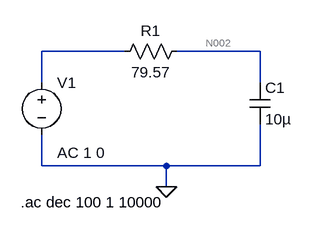
[diagram p0: schematic Diagrama_Ej2.asc]
Diagrama_Ej2.asc, the LTspice schematic file:
Version 4
SHEET 1 880 680
WIRE 160 80 32 80
WIRE 368 80 240 80
WIRE 32 128 32 80
WIRE 368 128 368 80
WIRE 32 256 32 208
WIRE 224 256 32 256
WIRE 368 256 368 192
WIRE 368 256 224 256
WIRE 224 288 224 256
FLAG 224 288 0
SYMBOL voltage 32 112 R0
WINDOW 123 24 124 Left 2
WINDOW 39 0 0 Left 0
SYMATTR Value2 AC 1 0
SYMATTR InstName V1
SYMATTR Value ""
SYMBOL res 144 96 R270
WINDOW 0 32 56 VTop 2
WINDOW 3 0 56 VBottom 2
SYMATTR InstName R1
SYMATTR Value 79.57
SYMBOL cap 352 128 R0
SYMATTR InstName C1
SYMATTR Value 10µ
TEXT 0 312 Left 2 !.ac dec 100 1 10000

The netlist it stands for:
* Diagrama_Ej2.asc
V1 N001 0 AC 1 0
R1 N001 N002 79.57
C1 N002 0 10µ
.ac dec 100 1 10000
.backanno
.end

* Results of the author's LTspice run, read from the files saved beside the schematic
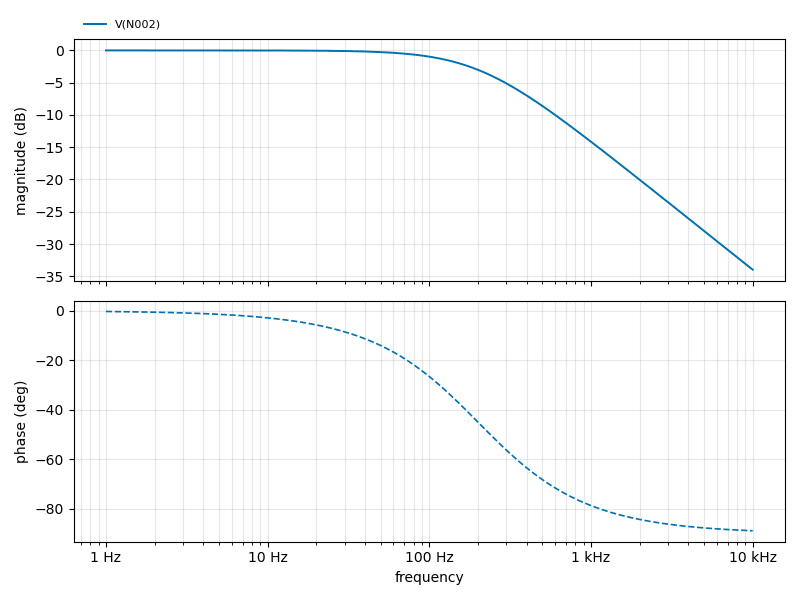
[diagram p1: AC Analysis of Diagrama_Ej2.asc, plotted from the saved traces]
* AC Analysis, 1 run:
*   V(N002): -0.00 dB at 1 Hz, -33.98 dB at 10 kHz, peak -0.00 dB at 1 Hz, 3 dB below the peak at 200 Hz